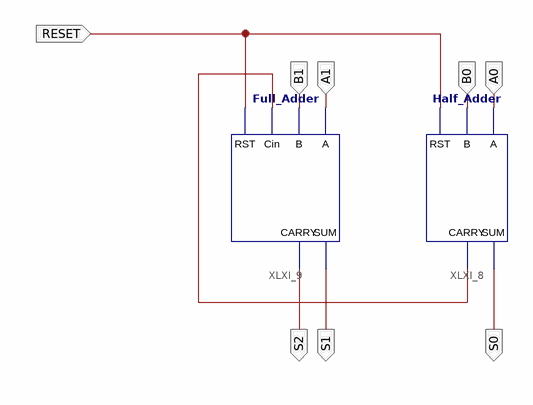
[diagram p0: schematic sheet 1]
// Xilinx ISE schematic Two_Bit_Adder.sch (spartan6) as structural Verilog: 2 symbols, 8 ports
module Two_Bit_Adder (
  input  RESET,
  input  A0,
  input  B0,
  input  A1,
  input  B1,
  output S2,
  output S1,
  output S0
);

  wire XLXN_26;

  Half_Adder XLXI_8 (.A(A0), .B(B0), .CARRY(XLXN_26), .RST(RESET), .SUM(S0));
  Full_Adder XLXI_9 (.A(A1), .B(B1), .CARRY(S2), .Cin(XLXN_26), .RST(RESET), .SUM(S1));
endmodule
